# Altium schematic sheet mcu.SchDoc
size A4; SheetNumber: 2; SheetTotal: 6
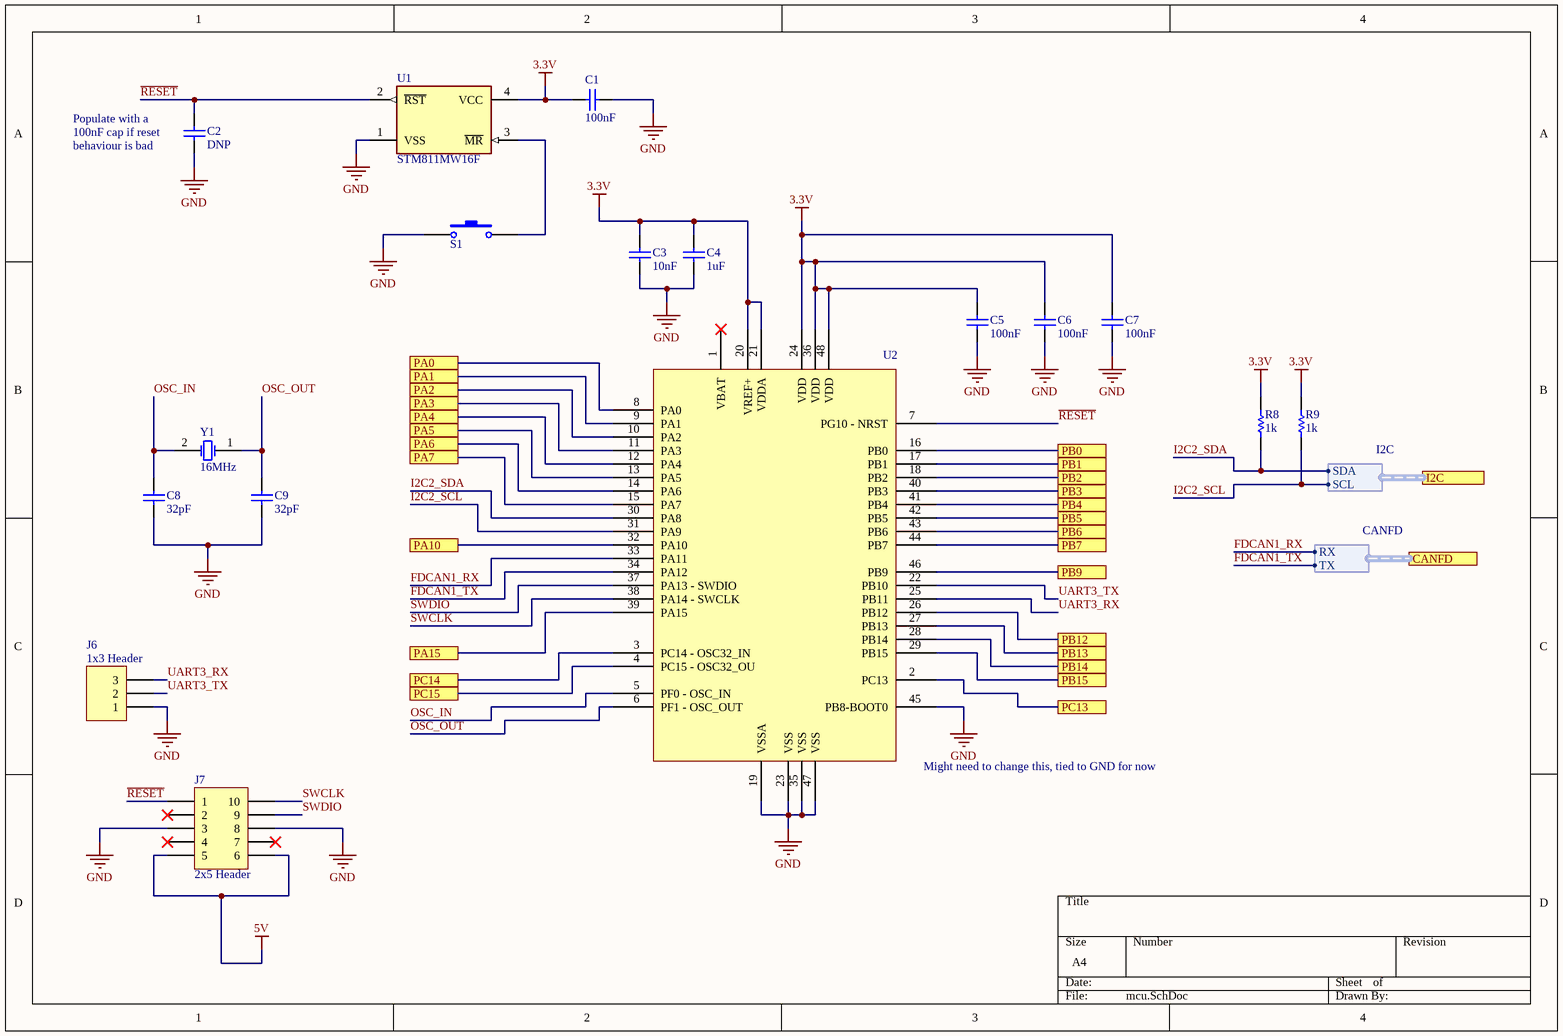
[diagram p0: mcu.SchDoc]

## Parts
C1  value 100nF  [0603 - Capacitor]  (hidden comment: Capacitor - Nonpolarized)
C2  value DNP  [0603 - Capacitor]  (hidden comment: Capacitor - Nonpolarized)
C3  value 10nF  [0603 - Capacitor]  (hidden comment: Capacitor - Nonpolarized)
C4  value 1uF  [0603 - Capacitor]  (hidden comment: Capacitor - Nonpolarized)
C5  value 100nF  [0603 - Capacitor]  (hidden comment: Capacitor - Nonpolarized)
C6  value 100nF  [0603 - Capacitor]  (hidden comment: Capacitor - Nonpolarized)
C7  value 100nF  [0603 - Capacitor]  (hidden comment: Capacitor - Nonpolarized)
C8  value 32pF  [0603 - Capacitor]  (hidden comment: Capacitor - Nonpolarized)
C9  value 32pF  [0603 - Capacitor]  (hidden comment: Capacitor - Nonpolarized)
J6  1x3 Header  [HDR1X3]
J7  2x5 Header  [HDR2x5]
R8  value 1k  [0603 - Resistor]  (hidden comment: Resistor)
R9  value 1k  [0603 - Resistor]  (hidden comment: Resistor)
S1  Switch - Push Button  [6x6mm Switch]  (value not drawn)
U1  STM811MW16F  [FP-SOT143-4-MFG]
U2  STM32G431C6T6  [TSQFP50P900X900X160-48N]  (value not drawn)
Y1  value 16MHz  [2-SMD NO LEAD CRSYSTAL]  (hidden comment: Oscillator)

## Ports
CANFD (harness CANFD), I2C (harness I2C), PA0, PA1, PA2, PA3, PA4, PA5, PA6, PA7, PA10, PA15, PB0, PB1, PB2, PB3, PB4, PB5, PB6, PB7, PB9, PB12, PB13, PB14, PB15, PC13, PC14, PC15

## Harnesses
CANFD: RX, TX
I2C: SDA, SCL

## Nets
3.3V: C1.2 C3.2 C4.2 C5.2 C6.2 C7.2 R8.2 R9.2 U1.4(VCC) U2.20(VREF+) U2.21(VDDA) U2.24(VDD) U2.36(VDD) U2.48(VDD)
5V: J7.5 J7.6
GND: C1.1 C2.1 C3.1 C4.1 C5.1 C6.1 C7.1 C8.1 C9.1 J6.1 J7.3 J7.8 S1.2 U1.1(VSS) U2.19(VSSA) U2.23(VSS) U2.35(VSS) U2.45(PB8-BOOT0) U2.47(VSS)
FDCAN1_RX: U2.33(PA11) ; port CANFD.RX
FDCAN1_TX: U2.34(PA12) ; port CANFD.TX
I2C2_SCL: R9.1 U2.31(PA9) ; port I2C.SCL
I2C2_SDA: R8.1 U2.30(PA8) ; port I2C.SDA
OSC_IN: C8.2 U2.5(PF0_-_OSC_IN) Y1.2(OSC2)
OSC_OUT: C9.2 U2.6(PF1_-_OSC_OUT) Y1.1(OSC1)
PA0: U2.8(PA0) ; port PA0
PA1: U2.9(PA1) ; port PA1
PA2: U2.10(PA2) ; port PA2
PA3: U2.11(PA3) ; port PA3
PA4: U2.12(PA4) ; port PA4
PA5: U2.13(PA5) ; port PA5
PA6: U2.14(PA6) ; port PA6
PA7: U2.15(PA7) ; port PA7
PA10: U2.32(PA10) ; port PA10
PA15: U2.39(PA15) ; port PA15
PB0: U2.16(PB0) ; port PB0
PB1: U2.17(PB1) ; port PB1
PB2: U2.18(PB2) ; port PB2
PB3: U2.40(PB3) ; port PB3
PB4: U2.41(PB4) ; port PB4
PB5: U2.42(PB5) ; port PB5
PB6: U2.43(PB6) ; port PB6
PB7: U2.44(PB7) ; port PB7
PB9: U2.46(PB9) ; port PB9
PB12: U2.26(PB12) ; port PB12
PB13: U2.27(PB13) ; port PB13
PB14: U2.28(PB14) ; port PB14
PB15: U2.29(PB15) ; port PB15
PC13: U2.2(PC13) ; port PC13
PC14: U2.3(PC14_-_OSC32_IN) ; port PC14
PC15: U2.4(PC15_-_OSC32_OU) ; port PC15
~{RESET}: C2.2 J7.1 U1.2(~{RST}) U2.7(PG10_-_NRST)
SWCLK: J7.10 U2.38(PA14_-_SWCLK)
SWDIO: J7.9 U2.37(PA13_-_SWDIO)
UART3_RX: J6.3 U2.25(PB11)
UART3_TX: J6.2 U2.22(PB10)
NetS1_1: S1.1 U1.3(~{MR})

Not connected (* = marked no-connect by the designer): J7 2* 4* 7*; U2 1(VBAT)*

## Notes on the sheet
- (near C2) Populate with a
- (near C2) 100nF cap if reset
- (near C2) behaviour is bad
- (near U2) Might need to change this, tied to GND for now

## Library data of the parts
C1-C9 = Capacitor - Nonpolarized: Nonpolarized Capacitor; Supplier Part Number: *; Supplier: *; Manufacturer: *; Rating: *; Manufacturer Part Number: *
J6 = 1x3 Header: 1x3 Pin Header
J7 = 2x5 Header: 2x5 Pin Header
S1 = Switch - Push Button: Push Button Switch; Supplier: *; Manufacturer Part Number: *; Manufacturer: *; Supplier Part Number: *; Rating: *; Value: *
U1 = CMP-12155-000003-1: IC MPU RESET CIRC 4.38V SOT143-4; Manufacturer: STMicroelectronics; Standoff Height: 0.01mm; Max Power Dissipation: 320mW; Number Of Outputs: 1; Reset Type: Active Low; Min Supply Voltage: 1V; Nominal Supply Current: 5.5-7uA; Max Supply Voltage: 5.5V; Output Current: 20mA; Lead Free: Yes; Category: IC; Mouser Description: Supervisory Circuits 4.38V Reset 140ms; Automotive: No; Threshold Voltage: 4.38V; Temperature Range High: +85°C; ComponentLink2URL: https://www.st.com/resource/en/datasheet/stm811.pdf; Device Class L1: Integrated Circuits (ICs); Ambient Temperature Range High: +85°C; Height: 1.12mm; Digikey Description: IC MPU RESET CIRC 4.38V SOT143-4; ComponentLink2Description: Datasheet; RoHS: TRUE; Temperature Range Low: -40°C; Device Class L2: Power Management ICs; Temperature: -40°C to +85°C; Package: SOT143-4; Device Class L3: Voltage Supervisors; Octopart: https://octopart.com/stm811mw16f-stmicroelectronics-506032; Manufacturer Part Number: STM811MW16F; Ambient Temperature Range Low: -40°C
U2 = STM32G431C6T6: MCU 32BIT 32KB FLASH 48LQFP; Manufacturer: ST; Manufacturer Part Number: STM32G431C6T6; Supplier: Digikey; Supplier Part Number: STM32G431C6T6-ND
Y1 = Oscillator: Crystal Oscillator; Manufacturer Part Number: *; Manufacturer: *; Supplier Part Number: *; Supplier: *; Rating: *
R8 R9 = Resistor: Rating: *; Manufacturer Part Number: *; Manufacturer: *; Supplier Part Number: *; Supplier: *